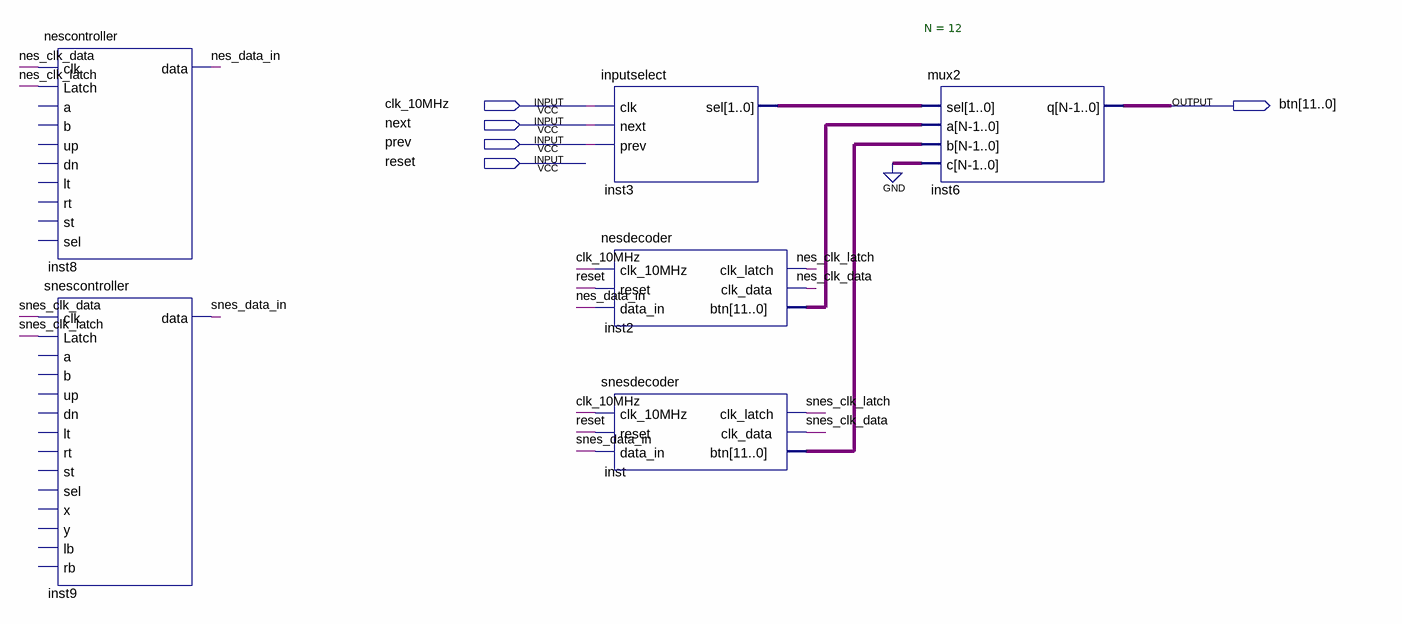
[diagram p0: schematic sheet]
// Quartus schematic designproject.bdf as structural Verilog: 6 symbols, 5 pins
module designproject (
  input  clk_10MHz,
  input  next,
  input  prev,
  input  reset,
  output [11:0] btn
);

  wire nes_clk_data, nes_clk_latch, nes_data_in, snes_clk_data, snes_clk_latch, snes_data_in;
  wire [1:0] inst3_sel;
  wire [11:0] inst2_btn, inst_btn;

  nescontroller inst8 (
    .clk(nes_clk_data), .Latch(nes_clk_latch), .data(nes_data_in));  // open: a, b, up, dn, lt, rt, st, sel
  snescontroller inst9 (
    .clk(snes_clk_data), .Latch(snes_clk_latch), .data(snes_data_in));  // open: a, b, up, dn, lt, rt, st, sel, x, y, lb, rb
  inputselect inst3 (.clk(clk_10MHz), .next(next), .prev(prev), .sel(inst3_sel));
  nesdecoder inst2 (
    .clk_10MHz(clk_10MHz), .reset(reset), .data_in(nes_data_in), .clk_latch(nes_clk_latch),
    .clk_data(nes_clk_data), .btn(inst2_btn));
  snesdecoder inst (
    .clk_10MHz(clk_10MHz), .reset(reset), .data_in(snes_data_in), .clk_latch(snes_clk_latch),
    .clk_data(snes_clk_data), .btn(inst_btn));
  mux2 #(.N(12)) inst6 (.sel(inst3_sel), .a(inst2_btn), .b(inst_btn), .c({12{1'b0}}), .q(btn));
endmodule
